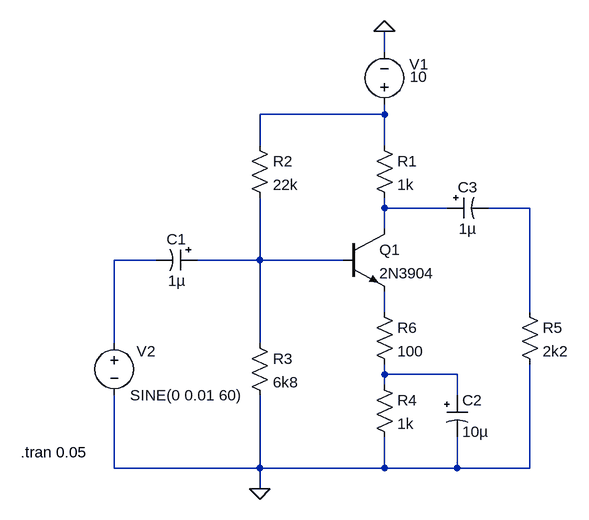
[diagram p0: schematic circuitos-electricos.asc]
circuitos-electricos.asc, the LTspice schematic file:
Version 4
SHEET 1 3704 1652
WIRE 240 -128 240 -160
WIRE 240 -32 240 -48
WIRE 240 -32 48 -32
WIRE 48 16 48 -32
WIRE 240 16 240 -32
WIRE 240 112 240 96
WIRE 336 112 240 112
WIRE 464 112 400 112
WIRE 240 144 240 112
WIRE -112 192 -176 192
WIRE 48 192 48 96
WIRE 48 192 -48 192
WIRE 176 192 48 192
WIRE 240 272 240 240
WIRE 464 272 464 112
WIRE -176 320 -176 192
WIRE 48 320 48 192
WIRE 240 368 240 352
WIRE 352 368 240 368
WIRE 240 384 240 368
WIRE 352 400 352 368
WIRE -176 512 -176 400
WIRE 48 512 48 400
WIRE 48 512 -176 512
WIRE 240 512 240 464
WIRE 240 512 48 512
WIRE 352 512 352 464
WIRE 352 512 240 512
WIRE 464 512 464 352
WIRE 464 512 352 512
WIRE 48 544 48 512
FLAG 240 -160 0
FLAG 48 544 0
SYMBOL npn 176 144 R0
SYMATTR InstName Q1
SYMATTR Value 2N3904
SYMBOL res 224 0 R0
SYMATTR InstName R1
SYMATTR Value 1k
SYMBOL res 32 0 R0
SYMATTR InstName R2
SYMATTR Value 22k
SYMBOL res 32 304 R0
SYMATTR InstName R3
SYMATTR Value 6k8
SYMBOL res 224 368 R0
SYMATTR InstName R4
SYMATTR Value 1k
SYMBOL polcap -48 176 R90
WINDOW 0 0 32 VBottom 2
WINDOW 3 32 32 VTop 2
SYMATTR InstName C1
SYMATTR Value 1µ
SYMBOL polcap 336 400 R0
SYMATTR InstName C2
SYMATTR Value 10µ
SYMBOL polcap 336 96 M90
WINDOW 0 0 32 VBottom 2
WINDOW 3 32 32 VTop 2
SYMATTR InstName C3
SYMATTR Value 1µ
SYMBOL voltage 240 -32 R180
WINDOW 0 -53 93 Bottom 2
WINDOW 3 -53 42 Top 2
WINDOW 123 0 0 Left 0
WINDOW 39 0 0 Left 0
SYMATTR InstName V1
SYMATTR Value 10
SYMBOL voltage -176 304 R0
WINDOW 0 34 28 Left 2
WINDOW 123 0 0 Left 0
WINDOW 39 0 0 Left 0
SYMATTR InstName V2
SYMATTR Value SINE(0 0.01 60)
SYMBOL res 448 256 R0
SYMATTR InstName R5
SYMATTR Value 2k2
SYMBOL res 224 256 R0
SYMATTR InstName R6
SYMATTR Value 100
TEXT -320 488 Left 2 !.tran 0.05

The netlist it stands for:
* circuitos-electricos.asc
Q1 N002 N005 N006 0 2N3904
R1 N001 N002 1k
R2 N001 N005 22k
R3 N005 0 6k8
R4 N007 0 1k
C1 N005 N004 1µ
C2 N007 0 10µ
C3 N002 N003 1µ
V1 N001 0 10
V2 N004 0 SINE(0 0.01 60)
R5 N003 0 2k2
R6 N006 N007 100
.model NPN NPN
.model PNP PNP
.lib standard.bjt
.tran 0.05
.backanno
.end